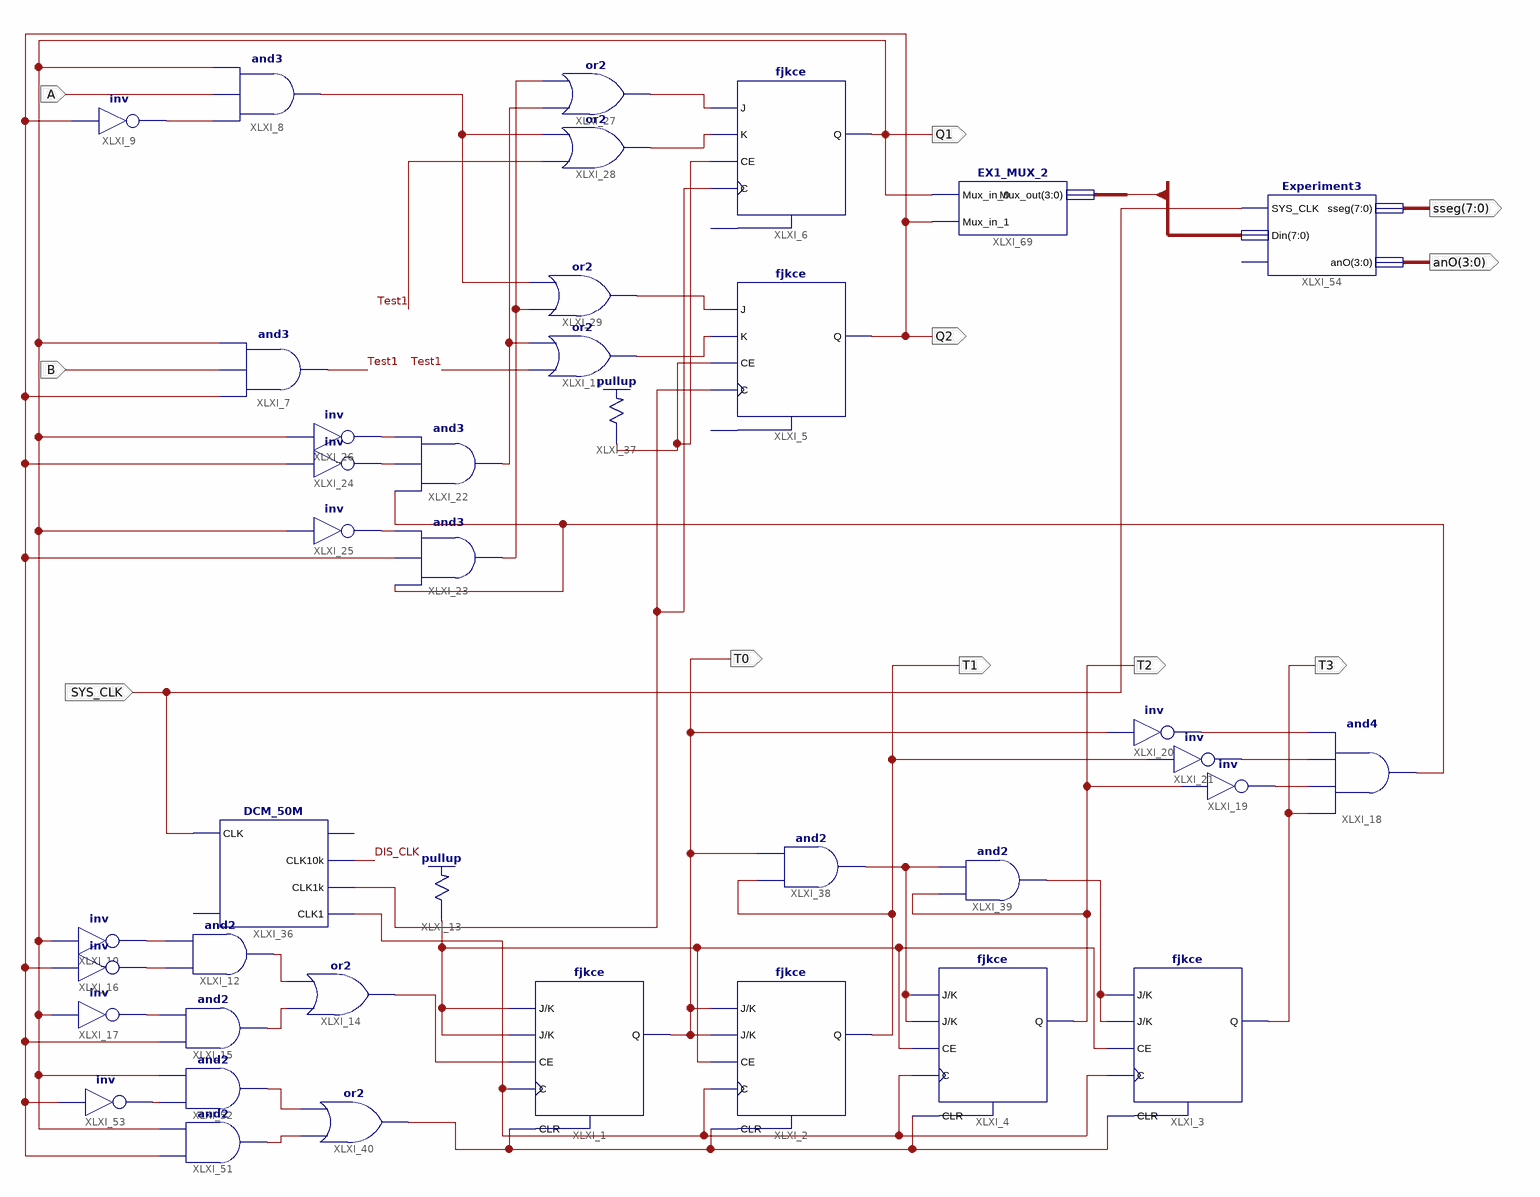
[diagram p0: schematic sheet 1]
// Xilinx ISE schematic Experiment1.sch (spartan3e) as structural Verilog: 39 symbols, 11 ports
module Experiment1 (
  input  A,
  input  B,
  input  SYS_CLK,
  output Q1,
  output Q2,
  output T2,
  output T0,
  output T1,
  output T3,
  output [7:0] sseg,
  output [3:0] anO
);

  wire DIS_CLK, Test1, XLXN_1, XLXN_3, XLXN_5, XLXN_24, XLXN_28, XLXN_29, XLXN_30, XLXN_31, XLXN_37, XLXN_38,
       XLXN_43, XLXN_45, XLXN_46, XLXN_50, XLXN_51, XLXN_53, XLXN_54, XLXN_55, XLXN_58, XLXN_65, XLXN_67,
       XLXN_82, XLXN_93, XLXN_96, XLXN_105, XLXN_108, XLXN_111, XLXN_125, XLXN_126, XLXN_129, XLXN_130;
  wire [7:0] din;

  fjkce XLXI_1 (.C(XLXN_28), .CE(XLXN_111), .CLR(XLXN_130), .J(XLXN_24), .K(XLXN_24), .Q(T0));
  fjkce XLXI_2 (.C(XLXN_28), .CE(XLXN_24), .CLR(XLXN_130), .J(T0), .K(T0), .Q(T1));
  fjkce XLXI_3 (.C(XLXN_28), .CE(XLXN_24), .CLR(XLXN_130), .J(XLXN_108), .K(XLXN_108), .Q(T3));
  fjkce XLXI_4 (.C(XLXN_28), .CE(XLXN_24), .CLR(XLXN_130), .J(XLXN_105), .K(XLXN_105), .Q(T2));
  fjkce XLXI_5 (.C(XLXN_96), .CE(XLXN_93), .J(XLXN_67), .K(XLXN_5), .Q(Q2));  // open: CLR
  fjkce XLXI_6 (.C(XLXN_96), .CE(XLXN_93), .J(XLXN_58), .K(XLXN_65), .Q(Q1));  // open: CLR
  and XLXI_7 (Test1, Q2, B, Q1);
  and XLXI_8 (XLXN_3, XLXN_1, A, Q1);
  not XLXI_9 (XLXN_1, Q2);
  \pullup  XLXI_13 (.O(XLXN_24));
  or XLXI_14 (XLXN_111, XLXN_30, XLXN_29);
  and XLXI_18 (XLXN_53, T3, XLXN_46, XLXN_43, XLXN_45);
  not XLXI_19 (XLXN_46, T2);
  not XLXI_20 (XLXN_45, T0);
  not XLXI_21 (XLXN_43, T1);
  and XLXI_22 (XLXN_54, XLXN_53, XLXN_50, XLXN_55);
  and XLXI_23 (XLXN_82, XLXN_53, Q2, XLXN_51);
  not XLXI_24 (XLXN_50, Q2);
  not XLXI_25 (XLXN_51, Q1);
  not XLXI_26 (XLXN_55, Q1);
  or XLXI_27 (XLXN_58, XLXN_54, XLXN_82);
  or XLXI_28 (XLXN_65, Test1, XLXN_3);
  or XLXI_29 (XLXN_67, XLXN_82, XLXN_3);
  or XLXI_11 (XLXN_5, Test1, XLXN_54);
  DCM_50M XLXI_36 (.CLK(SYS_CLK), .CLK10k(DIS_CLK), .CLK1k(XLXN_96), .CLK1(XLXN_28));  // open: RST, CLK1M
  \pullup  XLXI_37 (.O(XLXN_93));
  and XLXI_38 (XLXN_105, T1, T0);
  and XLXI_39 (XLXN_108, T2, XLXN_105);
  or XLXI_40 (XLXN_130, XLXN_126, XLXN_125);
  and XLXI_15 (XLXN_30, Q2, XLXN_38);
  not XLXI_17 (XLXN_38, Q1);
  not XLXI_16 (XLXN_37, Q2);
  not XLXI_10 (XLXN_31, Q1);
  and XLXI_12 (XLXN_29, XLXN_37, XLXN_31);
  and XLXI_51 (XLXN_126, Q2, Q1);
  and XLXI_52 (XLXN_125, XLXN_129, Q1);
  not XLXI_53 (XLXN_129, Q2);
  Experiment3 XLXI_54 (.SYS_CLK(SYS_CLK), .Din(din), .sseg(sseg), .anO(anO));  // open: En
  EX1_MUX_2 XLXI_69 (.Mux_in_0(Q1), .Mux_in_1(Q2), .Mux_out(din[3:0]));
endmodule
